# Altium project AIR_MONITOR_MAIN.PrjPcb
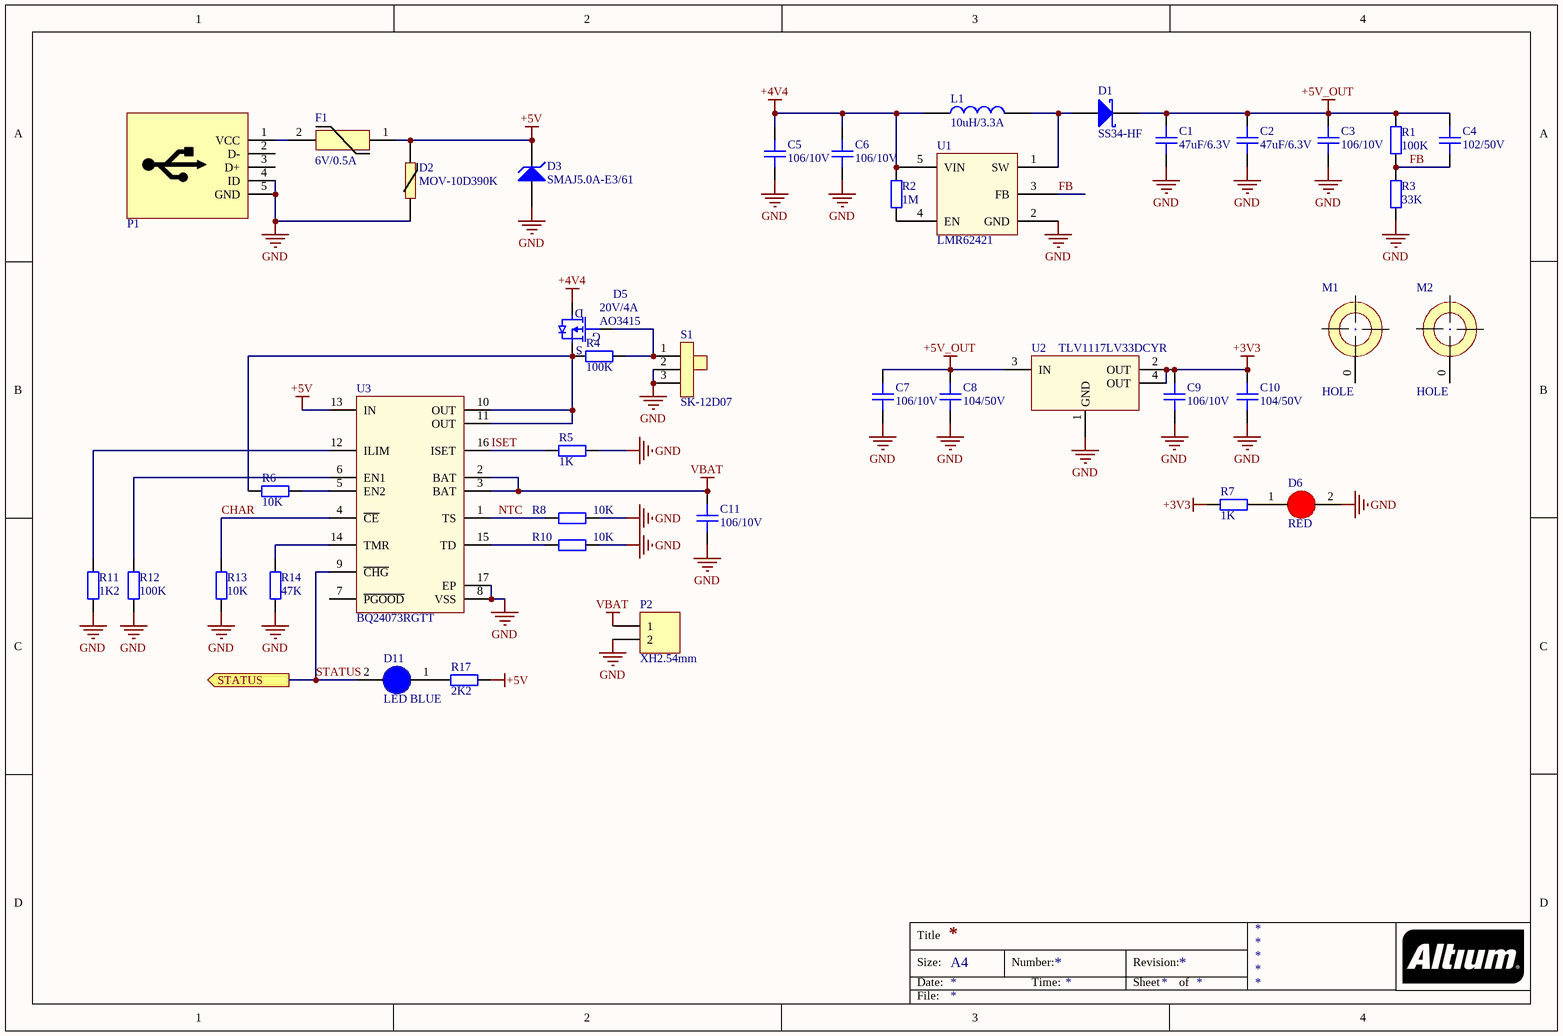
[diagram p0: POWER.SchDoc]
CURRENTREVISION: A00; globalprojectlink: CC2650_MONITOR; GLOBALPROJECTTEAM: THAI
2 sheets, 107 parts. Net scope: flat (ports and power ports of the same name join across sheets).
Board file: PCB_MAIN.PcbDoc
Sheets:
  POWER.SchDoc
  MAIN.SchDoc

## Sheet POWER.SchDoc
size A4

### Parts
C1  47uF/6.3V  [CAPC-0603 (1608) - HD]
C2  47uF/6.3V  [CAPC-0603 (1608) - HD]
C3  106/10V  [CAPC-0603 (1608) - HD]
C4  102/50V  [CAPC-0603 (1608) - HD]
C5  106/10V  [CAPC-0603 (1608) - HD]
C6  106/10V  [CAPC-0603 (1608) - HD]
C7  106/10V  [CAPC-0603 (1608) - HD]
C8  104/50V  [CAPC-0603 (1608) - HD]
C9  106/10V  [CAPC-0603 (1608) - HD]
C10  104/50V  [CAPC-0603 (1608) - HD]
C11  106/10V  [CAPC-0603 (1608) - HD]
D1  SS34-HF  [DIODE_DO214AC_SMA]
D2  MOV-10D390K  [MOV-07D101KTR]
D3  SMAJ5.0A-E3/61  [DIODE_DO214AC_SMA]
D5  20V/4A  [SOT23_3]
D6  RED  [LED 0603]
D11  LED BLUE  [LED_3MM-RED - duplicate]
F1  6V/0.5A  [FUSE 0ZCK_BEL]
L1  10uH/3.3A  [IND-74404084150]
M1  HOLE  [HOLE_3MM_6MM]  (no BOM)
M2  HOLE  [HOLE_3MM_6MM]  (no BOM)
P1  Micro USB  [MK5P MICROUSB]  (value not drawn)
P2  XH2.54mm  [XH2.54-2P]
R1  100K  [RESC-0603 (1608) - HD]
R2  1M  [RESC-0603 (1608) - HD]
R3  33K  [RESC-0603 (1608) - HD]
R4  100K  [RESC-0603 (1608) - HD]
R5  1K  [RESC-0603 (1608) - HD]
R6  10K  [RESC-0603 (1608) - HD]
R7  1K  [RESC-0603 (1608) - HD]
R8  10K  [RESC-0603 (1608) - HD]
R10  10K  [RESC-0603 (1608) - HD]
R11  1K2  [RESC-0603 (1608) - HD]
R12  100K  [RESC-0603 (1608) - HD]
R13  10K  [RESC-0603 (1608) - HD]
R14  47K  [RESC-0603 (1608) - HD]
R17  2K2  [RESC-0603 (1608) - HD]
S1  SK-12D07  [SK-12D07]
U1  LMR62421  [SC-74A]
U2  TLV1117LV33DCYR  [SOT-223-4]
U3  BQ24073RGTT  [RGT16-1700X1700TP]

### Ports
STATUS (out)

### Nets
+3V3: C9.2 C10.2 R7.1 U2.2(OUT) U2.4(OUT)
+4V4: C5.2 C6.2 D5.3(D) L1.1 R2.2 U1.5(VIN)
+5V: D2.2(K) D3.2(K) F1.1 R17.2 U3.13(IN)
+5V_OUT: C1.2 C2.2 C3.2 C4.2 C7.2 C8.2 D1.2(K) R1.2 U2.3(IN)
GND: C1.1 C2.1 C3.1 C5.1 C6.1 C7.1 C8.1 C9.1 C10.1 C11.1 D2.1(A) D3.1(A) D6.2(K) P1.4(ID) P1.5(GND) P2.2 R3.1 R5.2 R8.2 R10.2 R11.1 R12.1 R13.1 R14.1 S1.2(+) S1.3(+) U1.2(GND) U2.1(GND) U3.8(VSS) U3.17(EP)
VBAT: C11.2 P2.1 U3.2(BAT) U3.3(BAT)
CHAR: R13.2 U3.4(~{CE})
FB: C4.1 R1.1 R3.2 U1.3(FB)
ISET: R5.1 U3.16(ISET)
NTC: R8.1 U3.1(TS)
STATUS: D11.2(K) U3.9(~{CHG}) ; port STATUS
NetD1_1: D1.1(A) L1.2 U1.1(SW)
NetD5_1: D5.1(G) R4.1 S1.1(+)
NetD5_2: D5.2(S) R4.2 R6.1 U3.10(OUT) U3.11(OUT)
NetD6_1: D6.1(A) R7.2
NetD11_1: D11.1(A) R17.1
NetF1_2: F1.2 P1.1(VCC)
NetR2_1: R2.1 U1.4(EN)
NetR6_2: R6.2 U3.5(EN2)
NetR10_1: R10.1 U3.15(TD)
NetR11_2: R11.2 U3.12(ILIM)
NetR12_2: R12.2 U3.6(EN1)
NetR14_2: R14.2 U3.14(TMR)

Not connected (* = marked no-connect by the designer): M1 0; M2 0; P1 2(D-) 3(D+); U3 7(~{PGOOD})

### Notes on the sheet
- Title
- Size:
- Date:
- A4
- Number:
- Time:
- Revision:
- Sheet
- of
- File:

### Library data of the parts
C1 C2 = GRM188R60J476ME15D: CAP CER 47UF 6.3V X5R 0603; MFR: Murata Electronics; MPN: GRM188R60J476ME15D; Value: 47uF/6.3V; Category: CAPACITOR; SOLDER: CAP-0603
C3 C5 C6 C11 = CL10A106KP8NNNC: CAP CER 10uF 10% 10V X5R 0603; MFR: Samsung Electro-Mechanics; Solder: SMT; Conpany ID: VT00807; MPN: CL10A106KP8NNNC; Value: 106/10V; Category: Capacitor
C4 = CL10B102KB8NNNC: CAP CER 1000pF 10% 50V X7R 0603; Solder: SMT; Company ID: VT00062; Value: 102/50V; MPN: CL10B102KB8NNNC
C7 C9 = CL10A106KP8NNNC: CAP CER 10uF 10% 10V X5R 0603; CompanyID: VT-00984; Solder: SMT; MPN: CL10A106KP8NNNC; Value: 106/10V; Category: CAPACITOR
C8 C10 = C0603C104K5RACTU: CAP CER 0.1uF 50V 10% X7R 0603; Solder: SMT; Company ID: VT00574; MPN: C0603C104K5RACTU; Value: 104/50V
D1 = SS34-HF: DIODE SCHOTTKY 40V 3A SMA; MFR: onsemi; Solder: DO214AC; Company ID: VT00542; MPN: SS34-HF; Value: SS34-HF
D2 = MOV-10D390K: VARISTOR 39V 500A DISC 10MM; MFR: Bourns Inc.; Solder: WAVE; Value: MOV-10D390K; Category: VARISTOR; MPN: MOV-10D390K
D3 = SMAJ5.0A-E3/61: DIODE TVS 5VWM 9.2VC SMA; Solder: SMT; Company ID: VT00183; Value: SMAJ5.0A-E3/61; MPN: SMAJ5.0A-E3/61
D5 = AO3415: MOSFET P-CH 20V 4A SOT23; MFR: Alpha & Omega Semiconductor Inc.; Company ID: VT00490; CATEGORY: DIODE; SOLDER: SOT23; VALUE: 20V/4A; MPN: AO3415
D6 = LED 0603 RED: Solder: 0603; Company ID: VT00361; MPN: LED 0603 RED; Category: LED Diode; Value: RED
D11 = LED BLUE 3MM: LED BLUE 3MM ROUND T/H; MFR: China; Solder: WAVE; MPN: LED BLUE 3MM; Value: LED BLUE
F1 = 0ZCK0050FF2E: PTC RESET FUSE 6V 500MA 0805; Manufacturer: Bel Fuse Inc.; Solder: SMT; Company ID: VT00196; MPN: 0ZCK0050FF2E; Category: Fuse; Value: 6V/0.5A
L1 = SWPA8040S100MT: FIXED IND 10UH 3.3A 38 MOHM SMD; MFR: Shenzhen Sunlord Electronics Co., Ltd.; DCR: 38mOhm; MPN: SWPA8040S100MT; VALUE: 10uH/3.3A; CATEGORY: INDUCTOR
M1 M2 = HOLE_2_4/2_5/3_5/3_6: HOLE 2_4/2_5/3_5/3_6; MPN: None; Solder: Not Fill; CompanyID: VT-; ClassName: MECH_HOLE; Value: HOLE
P1 = MK5P_DIP: Micro USB Right Angle MK5P DIP; MFR: China; Solder: WAVE; LKCL: CL08132; MPN: MK5P_DIP; Category: CONNECTOR; Company ID: *; Value: Micro USB
P2 = XH2.54-2P: XH2.54mmm - 2P 180 degree; MFR: China; Company ID: VT01144; MPN: XH2.54-2P; Value: XH2.54mm
R1 R4 = RC0603FR-07100KL: RES SMD 100K OHM 1% 1/10W 0603; MFR: Yageo; Solder: SMT; Company ID: VT00424; MPN: RC0603FR-07100KL; Value: 100K; Category: Resistor
R2 = CRCW06031M00FKEA: RES SMD 1M OHM 1% 1/10W 0603; MFR: Vishay Dale; Solder: SMT; Company ID: VT00405; MPN: CRCW06031M00FKEA; Value: 1M; Category: Resistor
R3 = RC0603FR-0733KL: RES SMD 33K OHM 1% 1/10W 0603; Solder: SMT; MPN: RC0603FR-0733KL; Value: 33K
R5 R7 = RC0603FR-071KL: RES SMD 1 KOHM 1% 1/10W 0603; Solder: SMT; Company ID: VT00433; MPN: RC0603FR-071KL; Value: 1K
R6 R8 R10 R13 = RC0603FR-0710KL: RES SMD 10K OHM 1% 1/10W 0603; CompanyID: VT-00328; Solder: SMT; MPN: RC0603FR-0710KL; Value: 10K
R11 = RC0603FR-071K2L: RES SMD 1.2K OHM 1% 1/10W 0603; CompanyID: VT-01075; Solder: SMT; Value: 1K2; MPN: RC0603FR-071K2L
R12 = RC0603FR-07100KL: RES SMD 100K OHM 1% 1/10W 0603; Solder: SMT; CompanyID: VT-00332; MPN: RC0603FR-07100KL; Value: 100K
R14 = RC0603FR0747KL: RES SMD 47K OHM 1% 1/10W 0603; CompanyID: VT-00322; Solder: SMT; Value: 47K; MPN: RC0603FR0747KL
R17 = CRCW06032K20FKEA: RES SMD 2.2K OHM 1% 1/10W 0603; Solder: SMT; Company ID: VT00406; MPN: CRCW06032K20FKEA; Value: 2K2
S1 = SK-12D07: SK-12D07 Switch 5P; MFR: ChinaDaier; MPN: SK-12D07; Value: SK-12D07; Company ID: *
U1 = LMR62421XMFX/NOPB: IC REG BST SEPIC ADJ 2.1A SOT23; MFR: TI; Solder: SOT-753; MPN: LMR62421XMFX/NOPB; Category: IC; Company ID: *; Value: LMR62421
U2 = TLV1117LV33DCYR: IC REG LINEAR 3.3V 1A SOT223-4; Solder: SMT; Company ID: VT00286; Value: TLV1117LV33DCYR; MPN: TLV1117LV33DCYR; Category: IC
U3 = BQ24073RGTT: IC LI-ION CHARGE/PWR MGMT 16-QFN; MFR: Texas Instruments; Solder: 16-QFN (3x3); Company ID: VT00206; MPN: BQ24073RGTT; Category: IC; Value: BQ24073RGTT

## Sheet MAIN.SchDoc
size A3
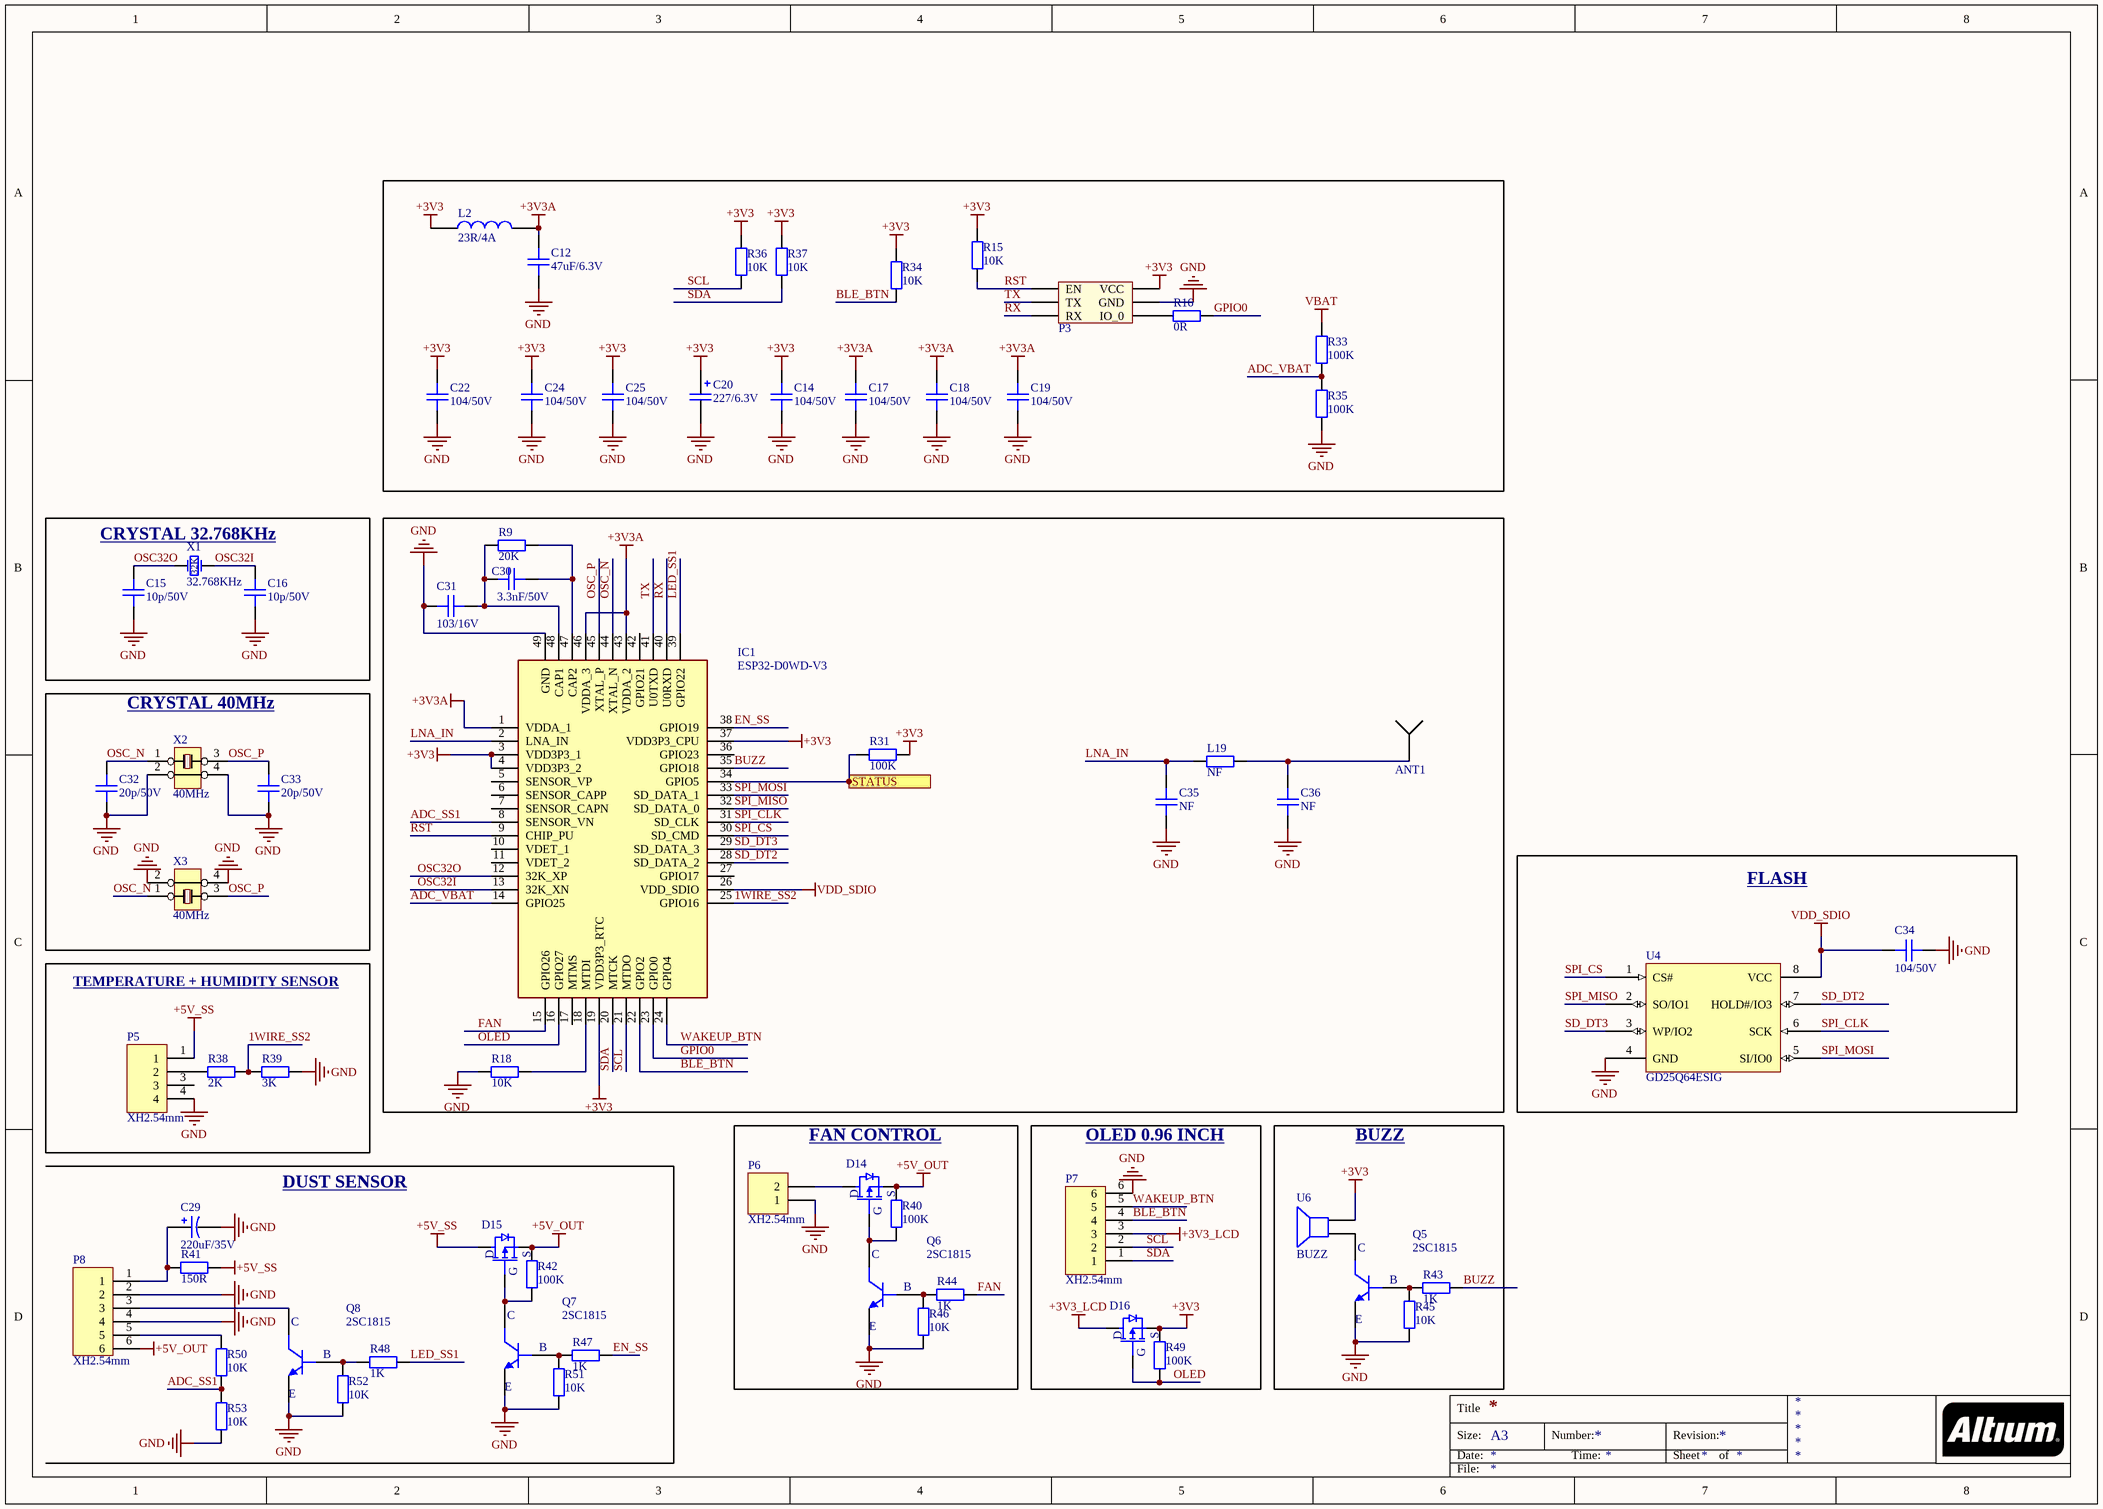
[diagram p1: MAIN.SchDoc]

### Parts
ANT1  (no value)  [SWRU120D]
C12  47uF/6.3V  [CAPC-0603 (1608) - HD]
C14  104/50V  [CAPC-0603 (1608) - HD]
C15  10p/50V  [CAPC-0603 (1608) - HD]
C16  10p/50V  [CAPC-0603 (1608) - HD]
C17  104/50V  [CAPC-0603 (1608) - HD]
C18  104/50V  [CAPC-0603 (1608) - HD]
C19  104/50V  [CAPC-0603 (1608) - HD]
C20  227/6.3V  [CAP_TANTAL_1210(3528)]
C22  104/50V  [CAPC-0603 (1608) - HD]
C24  104/50V  [CAPC-0603 (1608) - HD]
C25  104/50V  [CAPC-0603 (1608) - HD]
C29  220uF/35V  [CAP_ALUM_D8_13mm]
C30  3.3nF/50V  [CAPC-0603 (1608)]
C31  103/16V  [CAPC-0603 (1608)]
C32  20p/50V  [CAPC-0603 (1608) - HD]
C33  20p/50V  [CAPC-0603 (1608) - HD]
C34  104/50V  [CAPC-0603 (1608) - HD]
C35  NF  [CAPC-0603 (1608)]
C36  NF  [CAPC-0603 (1608)]
D14  20V/4A  [SOT23_3]  (value not drawn)
D15  20V/4A  [SOT23_3]  (value not drawn)
D16  20V/4A  [SOT23_3]  (value not drawn)
IC1  ESP32-D0WD-V3  [ESP32-D0WD]
L2  23R/4A  [IND-0603 (1608) - HD]
L19  NF  [RESC-0603 (1608)]
P3  DC3/6P  [DC3_6P_1.27]  (value not drawn)
P5  XH2.54mm  [XH2.54-4P]
P6  XH2.54mm  [XH2.54-2P]
P7  XH2.54mm  [XH2.54-6p]
P8  XH2.54mm  [XH2.54-6p]
Q5  2SC1815  [SOT23_3]
Q6  2SC1815  [SOT23_3]
Q7  2SC1815  [SOT23_3]
Q8  2SC1815  [SOT23_3]
R9  20K  [RESC-0603 (1608)]
R15  10K  [RESC-0603 (1608) - HD]
R16  0R  [RESC-0603 (1608) - HD]
R18  10K  [RESC-0603 (1608) - HD]
R31  100K  [RESC-0603 (1608) - HD]
R33  100K  [RESC-0603 (1608) - HD]
R34  10K  [RESC-0603 (1608) - HD]
R35  100K  [RESC-0603 (1608) - HD]
R36  10K  [RESC-0603 (1608) - HD]
R37  10K  [RESC-0603 (1608) - HD]
R38  2K  [RESC-0603 (1608) - HD]
R39  3K  [RESC-0603 (1608) - HD]
R40  100K  [RESC-0603 (1608) - HD]
R41  150R  [RESC-0603 (1608) - HD]
R42  100K  [RESC-0603 (1608) - HD]
R43  1K  [RESC-0603 (1608) - HD]
R44  1K  [RESC-0603 (1608) - HD]
R45  10K  [RESC-0603 (1608) - HD]
R46  10K  [RESC-0603 (1608) - HD]
R47  1K  [RESC-0603 (1608) - HD]
R48  1K  [RESC-0603 (1608) - HD]
R49  100K  [RESC-0603 (1608) - HD]
R50  10K  [RESC-0603 (1608) - HD]
R51  10K  [RESC-0603 (1608) - HD]
R52  10K  [RESC-0603 (1608) - HD]
R53  10K  [RESC-0603 (1608) - HD]
U4  GD25Q64ESIG  [GD25QXXE]
U6  BUZZ  [BUZZER_through_hole]
X1  32.768KHz  [CRYSTAL_ABS06 2x1.2mm]
X2  40MHz  [OSC-40M-3225]
X3  40MHz  [CRYSTAL-XRCGB27M120F3M10R0 (2x1.6)]

### Blocks framed on the sheet
CRYSTAL 32.768KHz: C15 C16 X1
CRYSTAL 40MHz: C32 C33 X2 X3
FLASH: C34 U4
TEMPERATURE + HUMIDITY SENSOR: P5 R38 R39
FAN CONTROL: D14 P6 Q6 R40 R44 R46
OLED 0.96 INCH: D16 P7 R49
BUZZ: Q5 R43 R45 U6

### Ports
STATUS (in)

### Nets
+3V3: C14.2 C20.1 C22.2 C24.2 C25.2 D16.2(S) IC1.3(VDD3P3_1) IC1.4(VDD3P3_2) IC1.19(VDD3P3_RTC) IC1.37(VDD3P3_CPU) L2.1 P3.2(VCC) R15.2 R31.1 R34.2 R36.2 R37.2 R49.2 U6.1
+3V3_LCD: D16.3(D) P7.3
+3V3A: C12.2 C17.2 C18.2 C19.2 IC1.1(VDDA_1) IC1.43(VDDA_2) IC1.46(VDDA_3) L2.2
+5V_OUT: D14.2(S) D15.2(S) P8.6 R40.2 R42.2
+5V_SS: D15.3(D) P5.1 R41.2
GND: C12.1 C14.1 C15.1 C16.1 C17.1 C18.1 C19.1 C20.2 C22.1 C24.1 C25.1 C29.2 C31.2 C32.1 C33.1 C34.1 C35.1 C36.1 IC1.49(GND) P3.4(GND) P5.4 P6.1 P7.6 P8.2 P8.4 Q5.2(E) Q6.2(E) Q7.2(E) Q8.2(E) R18.1 R35.1 R39.1 R45.1 R46.1 R51.1 R52.1 R53.1 U4.4(GND) X2.2 X2.4 X3.2 X3.4
VBAT: R33.2
VDD_SDIO: C34.2 IC1.26(VDD_SDIO) U4.8(VCC)
1WIRE_SS2: IC1.25(GPIO16) R38.1 R39.2
ADC_SS1: IC1.8(SENSOR_VN) R50.1 R53.2
ADC_VBAT: IC1.14(GPIO25) R33.1 R35.2
BLE_BTN: IC1.22(GPIO2) P7.4 R34.1
BUZZ: IC1.35(GPIO18) R43.2
EN_SS: IC1.38(GPIO19) R47.2
FAN: IC1.15(GPIO26) R44.2
GPIO0: IC1.23(GPIO0) R16.2
LED_SS1: IC1.39(GPIO22) R48.2
LNA_IN: C35.2 IC1.2(LNA_IN) L19.1
OLED: D16.1(G) IC1.16(GPIO27) R49.1
OSC32I: C16.2 IC1.13(32K_XN) X1.2(OSC2)
OSC32O: C15.2 IC1.12(32K_XP) X1.1(OSC1)
OSC_N: C32.2 IC1.44(XTAL_N) X2.1 X3.1
OSC_P: C33.2 IC1.45(XTAL_P) X2.3 X3.3
RST: IC1.9(CHIP_PU) P3.1(EN) R15.1
RX: IC1.40(U0RXD) P3.5(RX)
SCL: IC1.21(MTDO) P7.2 R36.1
SD_DT2: IC1.28(SD_DATA_2) U4.7(HOLD#/IO3)
SD_DT3: IC1.29(SD_DATA_3) U4.3(WP/IO2)
SDA: IC1.20(MTCK) P7.1 R37.1
SPI_CLK: IC1.31(SD_CLK) U4.6(SCK)
SPI_CS: IC1.30(SD_CMD) U4.1(CS#)
SPI_MISO: IC1.32(SD_DATA_0) U4.2(SO/IO1)
SPI_MOSI: IC1.33(SD_DATA_1) U4.5(SI/IO0)
STATUS: IC1.34(GPIO5) R31.2 ; port STATUS
TX: IC1.41(U0TXD) P3.3(TX)
WAKEUP_BTN: IC1.24(GPIO4) P7.5
NetANT1_1: ANT1.1 C36.2 L19.2
NetC29_1: C29.1 P8.1 R41.1
NetC30_1: C30.1 C31.1 IC1.48(CAP1) R9.1
NetC30_2: C30.2 IC1.47(CAP2) R9.2
NetD14_1: D14.1(G) Q6.3(C) R40.1
NetD14_3: D14.3(D) P6.2
NetD15_1: D15.1(G) Q7.3(C) R42.1
NetIC1_18: IC1.18(MTDI) R18.2
NetP3_6: P3.6(IO_0) R16.1
NetP5_2: P5.2 R38.2
NetP8_3: P8.3 Q8.3(C)
NetP8_5: P8.5 R50.2
NetQ5_1: Q5.1(B) R43.1 R45.2
NetQ5_3: Q5.3(C) U6.2
NetQ6_1: Q6.1(B) R44.1 R46.2
NetQ7_1: Q7.1(B) R47.1 R51.2
NetQ8_1: Q8.1(B) R48.1 R52.2

Not connected (* = marked no-connect by the designer): IC1 5(SENSOR_VP) 6(SENSOR_CAPP) 7(SENSOR_CAPN) 10(VDET_1) 11(VDET_2) 17(MTMS) 27(GPIO17) 36(GPIO23) 42(GPIO21); P5 3

### Notes on the sheet
- DUST SENSOR
- Title
- Size:
- Date:
- A3
- Number:
- Time:
- Revision:
- Sheet
- of
- File:
- (in symbol ABS06-107-32.768kHz-T) 32K

### Library data of the parts
ANT1 = SWRU120D
C12 = GMC10X5R476M6R3NT: CAP CER 47UF 6.3V X5R 0603; MFR: CAL-CHIP ELECTRONICS, INC.; MPN: GMC10X5R476M6R3NT; Solder: CAP-0603; Value: 47uF/6.3V; Category: CAPACITOR; PinCount: 2
C14 C17-C19 C22 C24 C25 C34 = C0603C104K5RACTU: CAP CER 0.1uF 50V 10% X7R 0603; CompanyID: VT-00982; Solder: SMT; MPN: C0603C104K5RACTU; Value: 104/50V; Category: CAPACITOR
C15 C16 = CL10C100JB8NNND: CAP CER 10pF 5% 50V NP0 0603; MFR: Samsung Electro-Mechanics; Solder: SMT; Company ID: VT00076; Value: 10p/50V; MPN: CL10C100JB8NNND; Category: Capacitor
C20 = T520B227M006ATE035: CAP TANT POLY 220uF 20% 6.3V 3528 35mOhm ESR; Solder: SMT; Company ID: VT00099; Value: 227/6.3V; MPN: T520B227M006ATE035
C29 = 860020574012: CAP ALUM 220UF 20% 35V RADIAL; MFR: Würth Elektronik; Solder: SMT; MPN: 860020574012; Value: 220uF/35V; Category: Capacitor; Digikey: 732-8946-1-ND
C30 = C0603C333K5RACTU: CAP CER 0.033UF 50V X7R 0603; Solder: SMT; MPN: C0603C333K5RACTU; Value: 3.3nF/50V; Category: CAPACITOR; PinCount: 2
C31 = CC0603KRX7R7BB103: CAP CER 10nF 16V 10% X7R 0603; Solder: SMT; MPN: CC0603KRX7R7BB103; Value: 103/16V; Category: CAPACITOR; PinCount: 2
C32 C33 = CL10C200JB8NNNC: CAP CER 20pF 5% 50V C0G/NP0 0603; Solder: SMT; Company ID: VT00080; Value: 20p/50V; MPN: CL10C200JB8NNNC
C35 C36 = CAPC NF 0603: CAP SMD, Not Fill, 0603; Solder: Not Fill; Value: NF; Category: CAPACITOR
D14-D16 = AO3415: as D5 on sheet POWER; CATEGORY: DIODE; SOLDER: SOT23; VALUE: 20V/4A; MPN: AO3415
IC1 = ESP32-D0WD-V3: Integrated Circuit; Manufacturer_Name: Espressif Systems; Datasheet Link: https://www.espressif.com/sites/default/files/documentation/esp32_datasheet_en.pdf; Height: 0.9mm; Manufacturer_Part_Number: ESP32-D0WD-V3
L2 = FBMJ1608HM230NT: IND-FERRITE BEAD 23 OHM  4A 0603 1LN; Solder: SMT; Company ID: VT00326; MPN: FBMJ1608HM230NT; Value: 23R/4A
L19 = RESC NF 0603: RES SMD, Not Fill, 0603; Solder: Not Fill; Value: NF; Category: RESISTOR
P3 = IDE_6P: MPN: DC3 6P 1.27mm; MFR: China; Category: Connector; Value: DC3/6P
P5 = XH2.54-4P: XH2.54mmm - 4P 180 degree; MPN: XH2.54-4P; Value: XH2.54mm
P6 = XH2.54-2P: as P2 on sheet POWER; MPN: XH2.54-2P; Value: XH2.54mm
P7 P8 = XH2.54-6p: XH2.54mmm - 6P 180 degree; MFR: CHINA; MPN: XH2.54-6P; Value: XH2.54mm
Q5-Q8 = 2SC1815: TRANS NPN 50V 0.15A SOT23-3; Solder: SMT; Company ID: VT00492; MPN: 2SC1815; Value: 2SC1815; Category: Transistor
R9 = RC0603FR-0720KL: RES SMD 20K OHM 1% 1/10W 0603; CompanyID: VT00429; Solder: SMT; MPN: RC0603FR-0720KL; Value: 20K; Category: RESISTOR
R15 R18 = RC0603FR-0710KL: RES SMD 10K OHM 1% 1/10W 0603; Solder: SMT; Company ID: VT00426; MPN: RC0603FR-0710KL; Value: 10K
R16 = RC0603FR-070R: RES SMD 0 OHM 1% 1/10W 0603; Solder: SMT; Company ID: VT00423; Value: 0R; MPN: RC0603FR-070R
R31 R33 R35 R40 R42 R49 = RC0603FR-07100KL: as R1 on sheet POWER; MPN: RC0603FR-07100KL; Value: 100K; Category: Resistor
R34 R36-R39 R45 R46 R50-R53 = RC0603FR-0710KL: RES SMD 10K OHM 1% 1/10W 0603; MFR: Yageo; Solder: SMT; Company ID: VT00426; MPN: RC0603FR-0710KL; Value: 10K; Category: Resistor
R41 = RC0603FR-07150RP: RES SMD 150 OHM 1% 1/10W 0603; MFR: YAGEO; MPN: RC0603FR-07150RP; CATEGORY: RESISTOR; SOLDER: RES-0603; Value: 150R; COMPANY ID: *
R43 R44 R47 R48 = RC0603FR-071KL: as R5 on sheet POWER; MPN: RC0603FR-071KL; Value: 1K
U4 = GD25Q64ESIG: IC FLASH 64MBIT 133MHZ SOIC-8; MFR: GD; MPN: GD25Q64ESIG; Solder: SOIC-8; Value: GD25Q64ESIG; Category: IC; COMPANY ID: *
U6 = Speaker: Loudspeaker; BAPartNumber: VT-0; MPN: CLA2021; Solder: WAVE; Published: 24-Mar-1999; LatestRevisionDate: 17-Jul-2002; LatestRevisionNote: Re-released for DXP Platform.; PackageReference: PIN2; Publisher: Altium Limited; Value: BUZZ; Parameter 1: *
X1 = ABS06-107-32.768kHz-T: CRYSTAL 32.7680KHZ 4pF SMD; MFR: Abracon LLC; Solder: SMT; Company ID: VT00159; Value: 32.768KHz; MPN: ABS06-107-32.768kHz-T; Category: Crystal
X2 = TXM40M0004322HBCEO00T: 40MHz ±10ppm 15pF 30Ω SMD-3225 SMD Crystal Resonators RoHS; MFR: TAE(Zhejiang Abel Elec); Value: 40MHz; MPN: TXM40M0004322HBCEO00T; Category: CRYSTAL; SOLDER: CRYS-3225
X3 = XRCGB40M000F4M01R0: CRYSTAL 40.0000MHZ 8PF SMD; MFR: Murata Electronics; Value: 40MHz; MPN: XRCGB40M000F4M01R0; Category: CRYSTAL; SOLDER: CRYS-2016; Company ID: *

## Nets that join several sheets
+3V3: POWER (5 pins), MAIN (19 pins)
+5V_OUT: POWER (9 pins), MAIN (5 pins)
GND: POWER (30 pins), MAIN (42 pins)
VBAT: POWER (C11.2 P2.1 U3.2 U3.3), MAIN (R33.2)
STATUS: POWER (D11.2 U3.9), MAIN (IC1.34 R31.2)